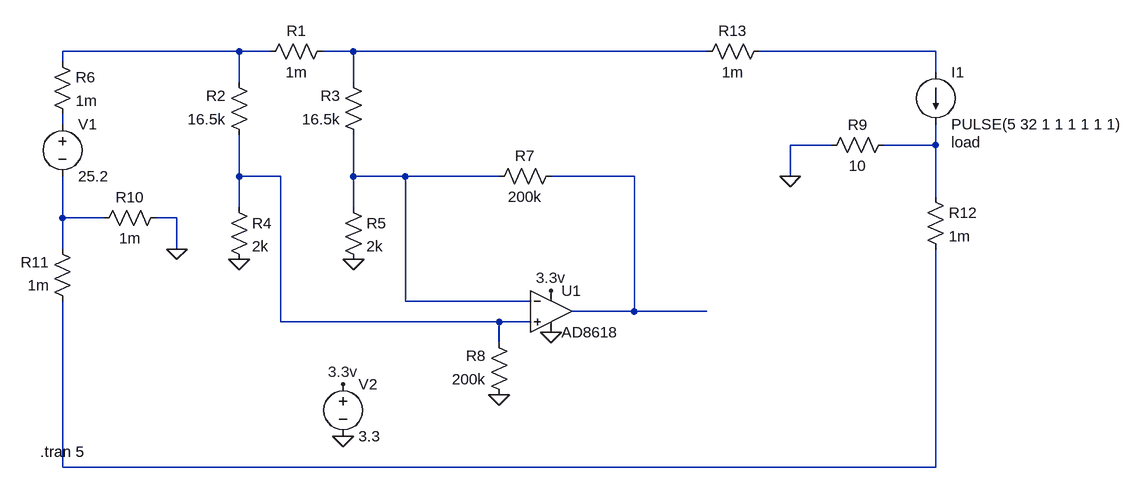
[diagram p0: schematic Current_Sense_32A.asc]
Current_Sense_32A.asc, the LTspice schematic file:
Version 4
SHEET 1 1464 680
WIRE 80 16 -192 16
WIRE 128 16 80 16
WIRE 256 16 208 16
WIRE 800 16 256 16
WIRE 1152 16 880 16
WIRE -192 32 -192 16
WIRE 1152 48 1152 16
WIRE 80 64 80 16
WIRE 256 64 256 16
WIRE -192 128 -192 112
WIRE 992 160 928 160
WIRE 1152 160 1152 128
WIRE 1152 160 1072 160
WIRE 80 208 80 144
WIRE 144 208 80 208
WIRE 256 208 256 144
WIRE 336 208 256 208
WIRE 480 208 336 208
WIRE 688 208 560 208
WIRE 928 208 928 160
WIRE 1152 240 1152 160
WIRE 80 256 80 208
WIRE 256 256 256 208
WIRE -192 272 -192 208
WIRE -128 272 -192 272
WIRE -16 272 -48 272
WIRE -192 320 -192 272
WIRE -16 320 -16 272
WIRE 336 400 336 208
WIRE 528 400 336 400
WIRE 688 416 688 208
WIRE 688 416 592 416
WIRE 800 416 688 416
WIRE 144 432 144 208
WIRE 480 432 144 432
WIRE 528 432 480 432
WIRE 480 464 480 432
WIRE -192 656 -192 400
WIRE 1152 656 1152 320
WIRE 1152 656 -192 656
FLAG 80 336 0
FLAG 256 336 0
FLAG 240 608 0
FLAG 560 448 0
FLAG 240 528 3.3v
FLAG 560 384 3.3v
FLAG 480 544 0
FLAG 928 208 0
FLAG -16 320 0
SYMBOL res 224 0 R90
WINDOW 0 0 56 VBottom 2
WINDOW 3 32 56 VTop 2
SYMATTR InstName R1
SYMATTR Value 1m
SYMBOL res 96 160 R180
WINDOW 0 36 76 Left 2
WINDOW 3 36 40 Left 2
SYMATTR InstName R2
SYMATTR Value 16.5k
SYMBOL res 272 160 R180
WINDOW 0 36 76 Left 2
WINDOW 3 36 40 Left 2
SYMATTR InstName R3
SYMATTR Value 16.5k
SYMBOL voltage -192 112 R0
SYMATTR InstName V1
SYMATTR Value 25.2
SYMBOL current 1152 48 R0
WINDOW 123 0 0 Left 0
WINDOW 39 24 108 Left 2
SYMATTR InstName I1
SYMATTR Value PULSE(5 32 1 1 1 1 1 1)
SYMATTR SpiceLine load
SYMBOL res 64 240 R0
SYMATTR InstName R4
SYMATTR Value 2k
SYMBOL res 240 240 R0
SYMATTR InstName R5
SYMATTR Value 2k
SYMBOL voltage 240 512 R0
SYMATTR InstName V2
SYMATTR Value 3.3
SYMBOL res -208 16 R0
SYMATTR InstName R6
SYMATTR Value 1m
SYMBOL Opamps\\AD8618 560 352 R0
SYMATTR InstName U1
SYMBOL res 576 192 R90
WINDOW 0 0 56 VBottom 2
WINDOW 3 32 56 VTop 2
SYMATTR InstName R7
SYMATTR Value 200k
SYMBOL res 496 560 R180
WINDOW 0 36 76 Left 2
WINDOW 3 36 40 Left 2
SYMATTR InstName R8
SYMATTR Value 200k
SYMBOL res 1088 144 R90
WINDOW 0 0 56 VBottom 2
WINDOW 3 32 56 VTop 2
SYMATTR InstName R9
SYMATTR Value 10
SYMBOL res -32 256 R90
WINDOW 0 0 56 VBottom 2
WINDOW 3 32 56 VTop 2
SYMATTR InstName R10
SYMATTR Value 1m
SYMBOL res -176 416 R180
WINDOW 0 36 76 Left 2
WINDOW 3 36 40 Left 2
SYMATTR InstName R11
SYMATTR Value 1m
SYMBOL res 1136 224 R0
SYMATTR InstName R12
SYMATTR Value 1m
SYMBOL res 896 0 R90
WINDOW 0 0 56 VBottom 2
WINDOW 3 32 56 VTop 2
SYMATTR InstName R13
SYMATTR Value 1m
TEXT -226 632 Left 2 !.tran 5

The netlist it stands for:
* Current_Sense_32A.asc
R1 N002 N001 1m
R2 N006 N001 16.5k
R3 N007 N002 16.5k
V1 N004 N009 25.2
I1 N003 N005 PULSE(5 32 1 1 1 1 1 1) load
R4 N006 0 2k
R5 N007 0 2k
V2 3.3v 0 3.3
R6 N001 N004 1m
XU1 N006 N007 3.3v 0 N008 AD8618  ; pins In+ In- V+ V- OUT
R7 N008 N007 200k
R8 0 N006 200k
R9 N005 0 10
R10 0 N009 1m
R11 N010 N009 1m
R12 N005 N010 1m
R13 N003 N002 1m
.tran 5
.backanno
.end